# EasyEDA schematic school.json
TITLE: Sheet_1; REV: 1.0; Date: 2025-09-05; Sheet: 1/1; Drawn By: amalanjula1; Company: Your Company
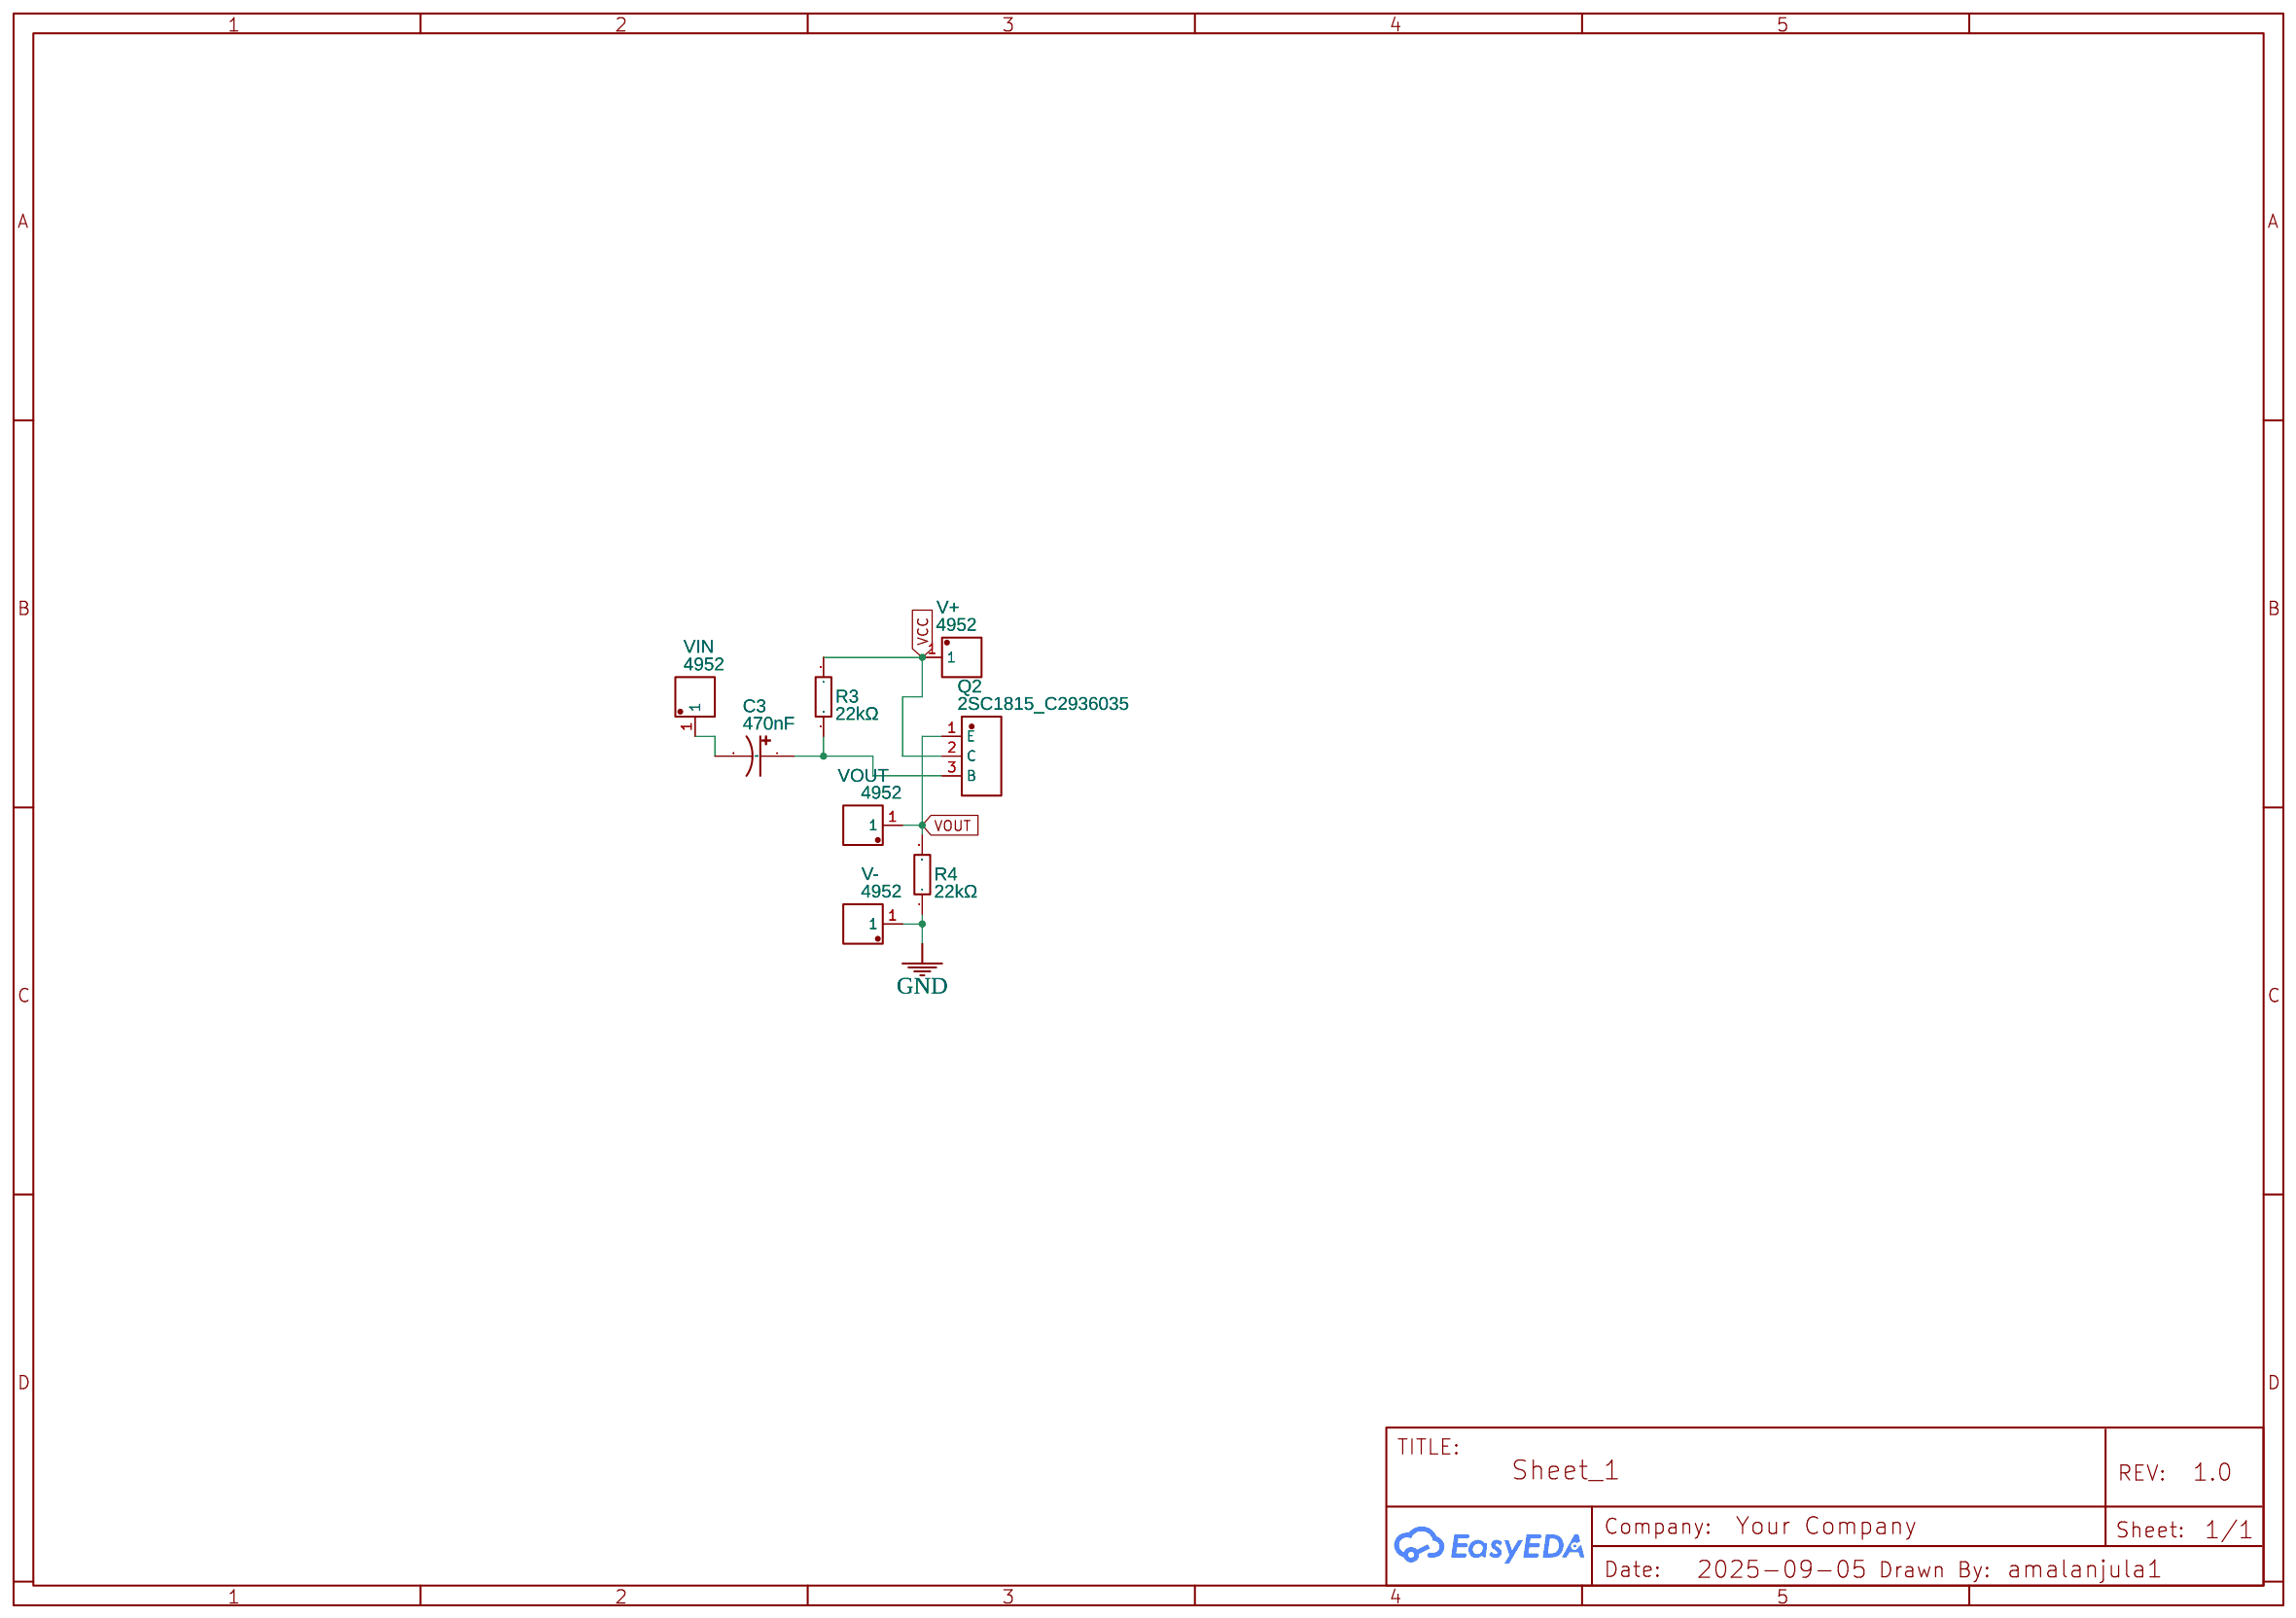
[diagram p0: schematic sheet]

## Parts
C3  470nF  [CAP-TH_BD5.0-P2.00-D0.8-FD]
Q2  2SC1815_C2936035  [TO-92-3_L4.6-W3.5-P1.27-L]
R3  22kΩ  [RES-TH_BD2.3-L6.5-P10.50-D0.5]
R4  22kΩ  [RES-TH_BD2.3-L6.5-P10.50-D0.5]
V+  4952  [CONN-TH_L3.0-W1.2]
V-  4952  [CONN-TH_L3.0-W1.2]
VIN  4952  [CONN-TH_L3.0-W1.2]
VOUT  4952  [CONN-TH_L3.0-W1.2]

## Library data of the parts
C3 = KMR47M050C110A: Contributor: LCSC; Supplier: LCSC; Supplier Part: C244347; Manufacturer: CapXon(丰宾); JLCPCB Part Class: Extended Part
Q2 = 2SC1815_C2936035: Contributor: LCSC; Supplier: LCSC; Supplier Part: C2936035; Manufacturer: Slkor(萨科微); Manufacturer Part: 2SC1815; JLCPCB Part Class: Extended Part
R3 R4 = MF1/4W-22KΩ±1% T52: Contributor: LCSC; Supplier: LCSC; Supplier Part: C119354; Manufacturer: CCO(千志电子); Manufacturer Part: MF1/4W-22KΩ±1% T; JLCPCB Part Class: Extended Part
V+ V- VIN VOUT = 4952: Contributor: LCSC; Supplier: LCSC; Supplier Part: C238118; Manufacturer: Keystone; JLCPCB Part Class: Extended Part

## Nets
GND: R4.1 V-.1
VCC: Q2.2(C) R3.2 V+.1
VOUT: Q2.1(E) R4.2 VOUT.1
Net-(C3-1): C3.1 Q2.3(B) R3.1
Net-(C3-2): C3.2 VIN.1
